# Altium project MGMEZZ02.PrjPcb (part 1 of 2)
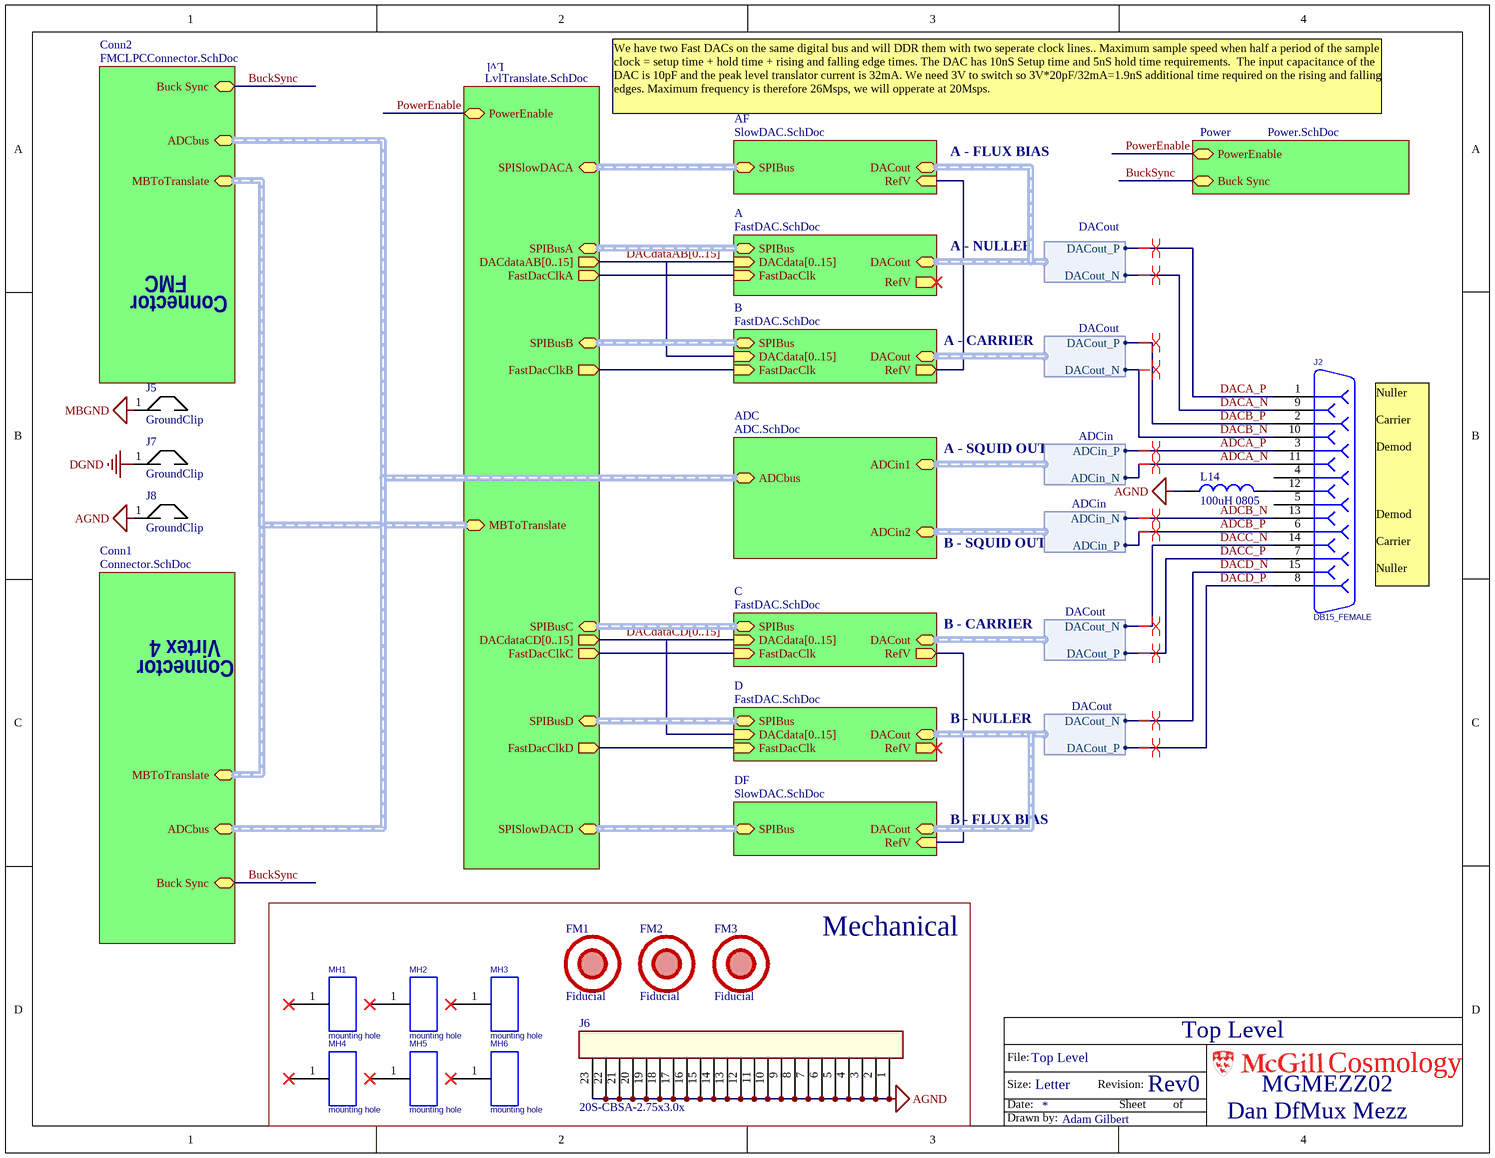
[diagram p0: MGMEZZ02.SchDoc]
ModelNumber: MGMEZZ02; ProjectTitle: Dan DfMux Mezz; Revision: Rev0
8 sheets, 571 parts. Net scope: hierarchical (ports join the sheet entries above them; power ports are global).
Board file: MGMEZZ02.PCBDOC
Sheets:
  MGMEZZ02.SchDoc
    ADC = ADC.SchDoc
    Power = Power.SchDoc
    A = FastDAC.SchDoc
    Conn1 = Connector.SchDoc
    Lvl = LvlTranslate.SchDoc
    AF = SlowDAC.SchDoc
    DF = SlowDAC.SchDoc
    Conn2 = FMCLPCConnector.SchDoc
    B = FastDAC.SchDoc
    C = FastDAC.SchDoc
    D = FastDAC.SchDoc

## Sheet MGMEZZ02.SchDoc: Top Level
size Letter; Author: Adam Gilbert; CompanyName: McGill University; DrawnBy: Adam Gilbert; Organization: Altium Limited; Address1: McGill Cosmology; Address2: 3600 University Street; Address3: Montreal, Quebec; Address4: Canada; Revision: Rev0; ProjectTitle: Dan DfMux Mezz; ModelNumber: MGMEZZ02; DocumentName: Top Level; ProjectName: Dan DfMux Mezz

### Parts
FM1  Fiducial  [Fiducial_mark]  (no BOM)
FM2  Fiducial  [Fiducial_mark]  (no BOM)
FM3  Fiducial  [Fiducial_mark]  (no BOM)
J2  DB15_FEMALE  [DSUB/RS.318/TM/15]
J5  GroundClip  [GroundClip]
J6  20S-CBSA-2.75x3.0x  [SHIELD 2.75X3.00]
J7  GroundClip  [GroundClip]
J8  GroundClip  [GroundClip]
L14  100uH 0805  [0805]
MH1  mounting hole  [MTHOLE.125]  (no BOM)
MH2  mounting hole  [MTHOLE.125]  (no BOM)
MH3  mounting hole  [MTHOLE.125]  (no BOM)
MH4  mounting hole  [MTHOLE.125]  (no BOM)
MH5  mounting hole  [MTHOLE.125]  (no BOM)
MH6  mounting hole  [MTHOLE.125]  (no BOM)

### Blocks framed on the sheet
Mechanical: FM1-FM3 J6 MH1-MH6

### Sub-sheets
A = FastDAC.SchDoc: DACout (harness DACout), SPIBus (harness SPIBus), FastDacClk (in), DACdata[0..15] (in), RefV (out)
ADC = ADC.SchDoc: ADCbus (harness ADCbus), ADCin1 (harness ADCin), ADCin2 (harness ADCin)
AF = SlowDAC.SchDoc: DACout (harness DACout), SPIBus (harness SPIBus), RefV (in)
B = FastDAC.SchDoc: DACout (harness DACout), SPIBus (harness SPIBus), FastDacClk (in), DACdata[0..15] (in), RefV (out)
C = FastDAC.SchDoc: DACout (harness DACout), SPIBus (harness SPIBus), FastDacClk (in), DACdata[0..15] (in), RefV (out)
Conn1 = Connector.SchDoc: ADCbus (harness ADCbus), MBToTranslate (harness MBToTranslate), Buck Sync
Conn2 = FMCLPCConnector.SchDoc: MBToTranslate (harness MBToTranslate), ADCbus (harness SlowDACin), Buck Sync
D = FastDAC.SchDoc: DACout (harness DACout), SPIBus (harness SPIBus), FastDacClk (in), DACdata[0..15] (in), RefV (out)
DF = SlowDAC.SchDoc: DACout (harness DACout), SPIBus (harness SPIBus), RefV (in)
Lvl = LvlTranslate.SchDoc: MBToTranslate (harness MBToTranslate), PowerEnable, SPISlowDACA (harness SPIBus), SPISlowDACD (harness SPIBus), SPIBusA (harness SPIBus), SPIBusB (harness SPIBus), SPIBusC (harness SPIBus), SPIBusD (harness SPIBus), DACdataAB[0..15] (out), FastDacClkA (out), FastDacClkB (out), DACdataCD[0..15] (out), FastDacClkC (out), FastDacClkD (out)
Power = Power.SchDoc: PowerEnable, Buck Sync

### Harnesses
ADCin: ADCin_P, ADCin_N
DACout: DACout_P, DACout_N

### Nets
AGND: J6.1 J6.2 J6.3 J6.4 J6.5 J6.6 J6.7 J6.8 J6.9 J6.10 J6.11 J6.12 J6.13 J6.14 J6.15 J6.16 J6.17 J6.18 J6.19 J6.20 J6.21 J6.22 J6.23 J8.1 L14.1
DGND: J7.1
MBGND: J5.1
ADCA_N: J2.11(p11) ; sheet ADC/ADCin1.ADCin_N
ADCA_P: J2.3(p3) ; sheet ADC/ADCin1.ADCin_P
ADCB_N: J2.13(p13) ; sheet ADC/ADCin2.ADCin_N
ADCB_P: J2.6(p6) ; sheet ADC/ADCin2.ADCin_P
BuckSync: sheet Power/Buck Sync, sheet Conn1/Buck Sync, sheet Conn2/Buck Sync
DACA_N: J2.9(p9) ; sheet A/DACout.DACout_N
DACA_P: J2.1(p1) ; sheet A/DACout.DACout_P
DACB_N: J2.10(p10) ; sheet B/DACout.DACout_N
DACB_P: J2.2(p2) ; sheet B/DACout.DACout_P
DACC_N: J2.14(p14) ; sheet C/DACout.DACout_N
DACC_P: J2.7(p7) ; sheet C/DACout.DACout_P
DACD_N: J2.15(p15) ; sheet DF/DACout.DACout_N
DACD_P: J2.8(p8) ; sheet DF/DACout.DACout_P
FastDacClk: sheet A/FastDacClk, sheet Lvl/FastDacClkA
FastDacClk: sheet Lvl/FastDacClkB, sheet B/FastDacClk  [a separate net that carries the same name]
FastDacClk: sheet Lvl/FastDacClkC, sheet C/FastDacClk  [a separate net that carries the same name]
FastDacClk: sheet Lvl/FastDacClkD, sheet D/FastDacClk  [a separate net that carries the same name]
PowerEnable: sheet Power/PowerEnable, sheet Lvl/PowerEnable
RefVolt: sheet AF/RefV, sheet B/RefV
RefVolt: sheet DF/RefV, sheet C/RefV  [a separate net that carries the same name]
NetJ2_12: J2.12(p12) L14.2

Not connected (* = marked no-connect by the designer): J2 4(p4) 5(p5); MH1 1(A)*; MH2 1(A)*; MH3 1(A)*; MH4 1(A)*; MH5 1(A)*; MH6 1(A)*

### Buses and harness runs
bus DACdataAB[0..15] = sheet A/DACdata[0..15] = sheet B/DACdata[0..15] = sheet Lvl/DACdataAB[0..15]
bus DACdataCD[0..15] = sheet C/DACdata[0..15] = sheet D/DACdata[0..15] = sheet Lvl/DACdataCD[0..15]
harness sheet A/DACout = sheet AF/DACout
harness sheet A/SPIBus = sheet Lvl/SPIBusA
harness sheet ADC/ADCbus = sheet Conn1/ADCbus = sheet Conn2/ADCbus
harness sheet AF/SPIBus = sheet Lvl/SPISlowDACA
harness sheet B/SPIBus = sheet Lvl/SPIBusB
harness sheet C/SPIBus = sheet Lvl/SPIBusC
harness sheet Conn1/MBToTranslate = sheet Conn2/MBToTranslate = sheet Lvl/MBToTranslate
harness sheet D/DACout = sheet DF/DACout
harness sheet D/SPIBus = sheet Lvl/SPIBusD
harness sheet DF/SPIBus = sheet Lvl/SPISlowDACD

### Layout directives
differential pair: ADCA_N, ADCA_P, ADCB_N, ADCB_P, DACA_N, DACA_P, DACB_N, DACB_P, DACC_N, DACC_P, DACD_N, DACD_P

### Notes on the sheet
- We have two Fast DACs on the same digital bus and will DDR them with two seperate clock lines.. Maximum sample speed when half a period of the sample clock = setup time + hold time + rising and falling edge times. The DAC has 10nS Setup time and 5nS hold time requirements.  The input capacitance of the DAC is 10pF and the peak level translator current is 32mA. We need 3V to switch so 3V*20pF/32mA=1.9nS additional time required on the rising and falling edges. Maximum frequency is therefore 26Msps, we will opperate at 20Msps.
- A - FLUX BIAS
- FMC
- Connector
- A - NULLER
- A - CARRIER
- A - SQUID OUT
- B - SQUID OUT
- Virtex 4
- B - CARRIER
- Nuller
  Carrier
  Demod
  Demod
  Carrier
  Nuller
- B - NULLER
- B - FLUX BIAS
- File:
- Size:
- Date:
- Letter
- Revision:
- Sheet
- of
- Cosmology
- Drawn by:

### Library data of the parts
FM1-FM3 = Fiducial: Assembly Comments: none; Type: Fiducial; SupplierUnitCost: 0
J2 = DB15_FEMALE: Part Constraints: 182-015-213R181; Manufacturer: Norcomp; Assembly Comments: none; Manufacturers Part Number: 182-015-213R181; Supplier 1: Digi-Key; Supplier Part Number 1: 182-815FE-ND
J5 J7 J8 = GroundClip: Ground Clip point; Manufacturer: Keystone Electronics; Part Constraints: 5015; Assembly Comments: none; SupplierUnitCost: $0.53; Type: Ground clip point; Supplier 1: Digi-Key; Supplier Part Number 1: 5015KCT-ND; Manufacturers Part Number: 5015
J6 = MezzShield
L14 = IND 0805: Inductor 0805; Manufacturer: TDK Corporation; Manufacturers Part Number: GLCR2012T101M-HC; Part Constraints: 100uH, 4.5Ohms DRC, Irms 40mA; Assembly Comments: none; Type: Inductor; SupplierUnitCost: $0.33; Value: 100uH 0805
MH1-MH6 = MTHOLE

## Sheet ADC.SchDoc: ADC
size Letter; DrawnBy: AdamGilbert; Engineer: AdamGilbert; Revision: Rev0
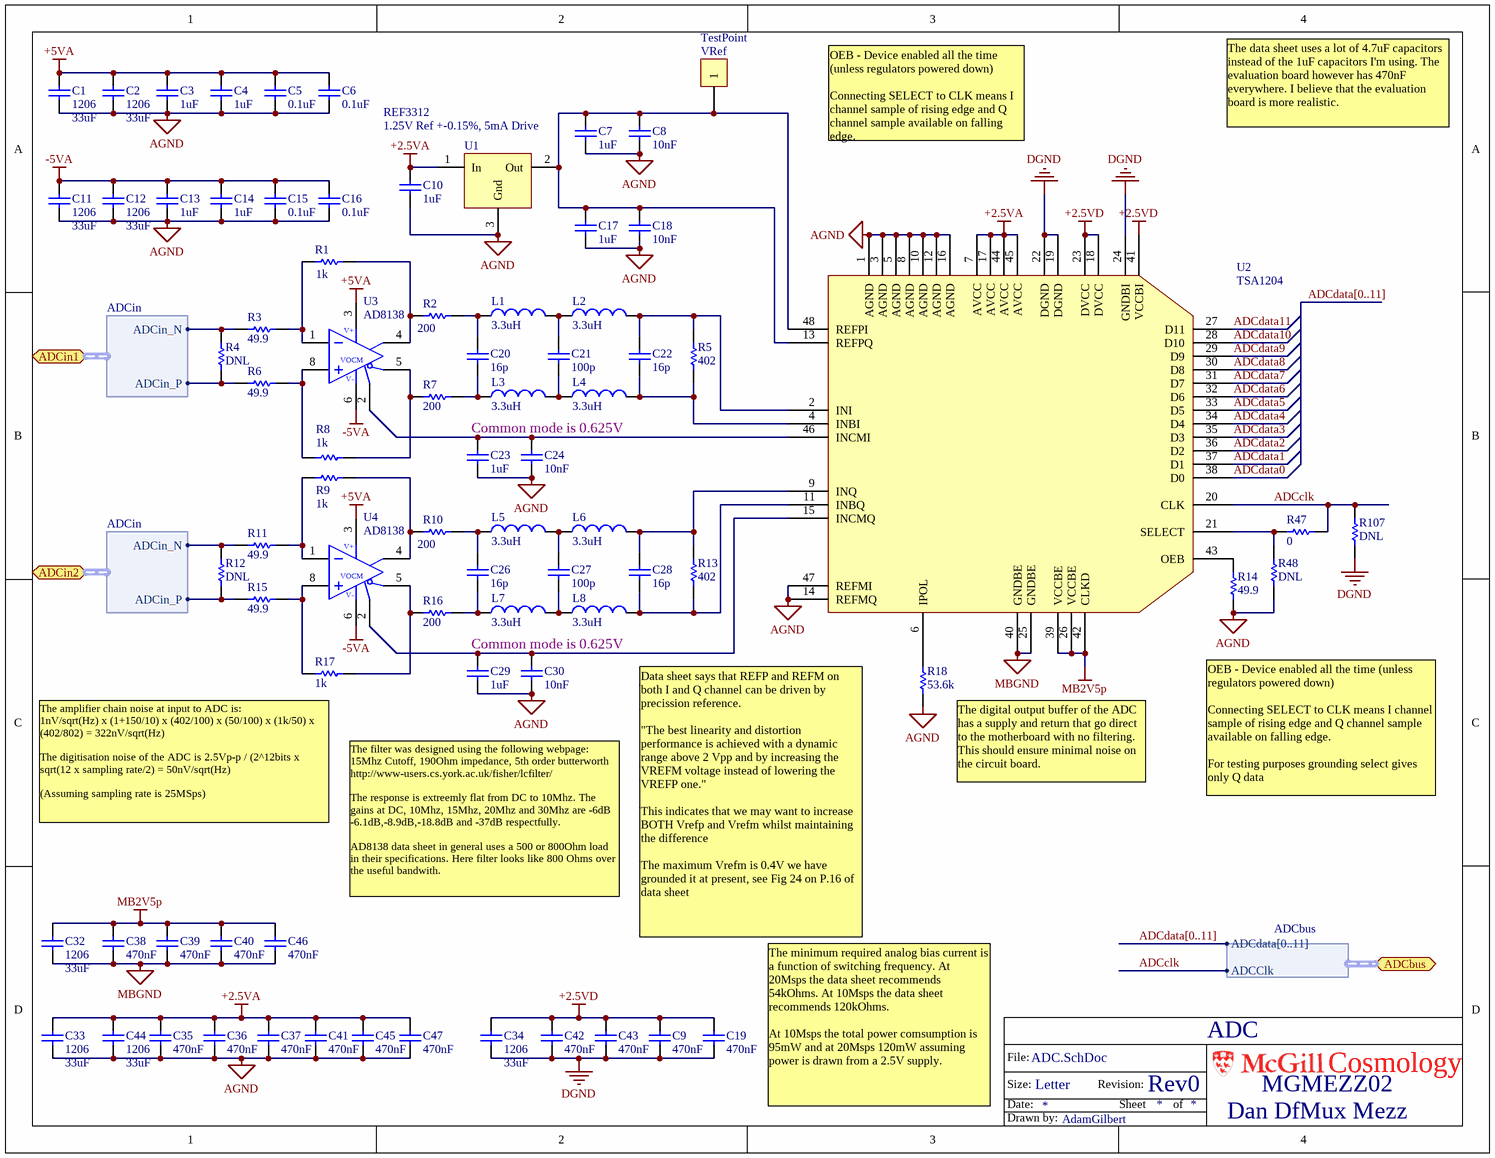
[diagram p1: ADC.SchDoc]

### Parts
C1  Footprint: 1206  [CC3225-1210]  (hidden comment: 33uF)
C2  Footprint: 1206  [CC3225-1210]  (hidden comment: 33uF)
C3  1uF  [0603]
C4  1uF  [0603]
C5  0.1uF  [0603]
C6  0.1uF  [0603]
C7  1uF  [0603]
C8  10nF  [0603]
C9  470nF  [0603]
C10  1uF  [0603]
C11  Footprint: 1206  [CC3225-1210]  (hidden comment: 33uF)
C12  Footprint: 1206  [CC3225-1210]  (hidden comment: 33uF)
C13  1uF  [0603]
C14  1uF  [0603]
C15  0.1uF  [0603]
C16  0.1uF  [0603]
C17  1uF  [0603]
C18  10nF  [0603]
C19  470nF  [0603]
C20  16p  [0603]
C21  100p  [0603]
C22  16p  [0603]
C23  1uF  [0603]
C24  10nF  [0603]
C26  16p  [0603]
C27  100p  [0603]
C28  16p  [0603]
C29  1uF  [0603]
C30  10nF  [0603]
C32  Footprint: 1206  [CC3225-1210]  (hidden comment: 33uF)
C33  Footprint: 1206  [CC3225-1210]  (hidden comment: 33uF)
C34  Footprint: 1206  [CC3225-1210]  (hidden comment: 33uF)
C35  470nF  [0603]
C36  470nF  [0603]
C37  470nF  [0603]
C38  470nF  [0603]
C39  470nF  [0603]
C40  470nF  [0603]
C41  470nF  [0603]
C42  470nF  [0603]
C43  470nF  [0603]
C44  Footprint: 1206  [CC3225-1210]  (hidden comment: 33uF)
C45  470nF  [0603]
C46  470nF  [0603]
C47  470nF  [0603]
L1  3.3uH  [0603]
L2  3.3uH  [0603]
L3  3.3uH  [0603]
L4  3.3uH  [0603]
L5  3.3uH  [0603]
L6  3.3uH  [0603]
L7  3.3uH  [0603]
L8  3.3uH  [0603]
R1  1k  [0603]
R2  200  [0603]
R3  49.9  [0603]
R4  DNL  [0603]
R5  402  [0603]
R6  49.9  [0603]
R7  200  [0603]
R8  1k  [0603]
R9  1k  [0603]
R10  200  [0603]
R11  49.9  [0603]
R12  DNL  [0603]
R13  402  [0603]
R14  49.9  [0603]
R15  49.9  [0603]
R16  200  [0603]
R17  1k  [0603]
R18  53.6k  [0603]
R47  0  [0603]
R48  DNL  [0603]
R107  DNL  [0603]
U1  REF3312  Description: 1.25V Ref +-0.15%, 5mA Drive  [SOT23]
U2  TSA1204  [TSQFP50P900X900X160-48N]
U3  AD8138  [SO8]
U4  AD8138  [SO8]
VRef  TestPoint  [TP-3520-SK]  (no BOM)

### Ports
ADCbus (harness ADCbus), ADCin1 (harness ADCin), ADCin2 (harness ADCin)

### Harnesses
ADCin: ADCin_P, ADCin_N
ADCbus: ADCdata[0..11], ADCClk

### Nets
+2.5VA: C10.2 C33.2 C35.2 C36.2 C37.2 C41.2 C44.2 C45.2 C47.2 U1.1(In) U2.7(AVCC) U2.17(AVCC) U2.44(AVCC) U2.45(AVCC)
+2.5VD: C9.2 C19.2 C34.2 C42.2 C43.2 U2.18(DVCC) U2.23(DVCC) U2.41(VCCBI)
+5VA: C1.2 C2.2 C3.2 C4.2 C5.1 C6.1 U3.3(V+) U4.3(V+)
-5VA: C11.2 C12.2 C13.2 C14.2 C15.1 C16.1 U3.6(V-) U4.6(V-)
AGND: C1.1 C2.1 C3.1 C4.1 C5.2 C6.2 C7.1 C8.1 C10.1 C11.1 C12.1 C13.1 C14.1 C15.2 C16.2 C17.1 C18.1 C23.1 C24.1 C29.1 C30.1 C33.1 C35.1 C36.1 C37.1 C41.1 C44.1 C45.1 C47.1 R14.1 R18.1 R48.2 U1.3(Gnd) U2.1(AGND) U2.3(AGND) U2.5(AGND) U2.8(AGND) U2.10(AGND) U2.12(AGND) U2.14(REFMQ) U2.16(AGND) U2.47(REFMI)
DGND: C9.1 C19.1 C34.1 C42.1 C43.1 R107.1 U2.19(DGND) U2.22(DGND) U2.24(GNDBI)
MB2V5p: C32.2 C38.2 C39.2 C40.2 C46.2 U2.26(VCCBE) U2.39(VCCBE) U2.42(CLKD)
MBGND: C32.1 C38.1 C39.1 C40.1 C46.1 U2.25(GNDBE) U2.40(GNDBE)
ADCA_N: R3.2 R4.2 ; port ADCin1.ADCin_N
ADCA_P: R4.1 R6.2 ; port ADCin1.ADCin_P
ADCB_N: R11.2 R12.2 ; port ADCin2.ADCin_N
ADCB_P: R12.1 R15.2 ; port ADCin2.ADCin_P
ADCclk: R47.1 R107.2 U2.20(CLK) ; port ADCbus.ADCClk
ADCdata0: U2.38(D0)
ADCdata1: U2.37(D1)
ADCdata2: U2.36(D2)
ADCdata3: U2.35(D3)
ADCdata4: U2.34(D4)
ADCdata5: U2.33(D5)
ADCdata6: U2.32(D6)
ADCdata7: U2.31(D7)
ADCdata8: U2.30(D8)
ADCdata9: U2.29(D9)
ADCdata10: U2.28(D10)
ADCdata11: U2.27(D11)
NetC7_2: C7.2 C8.2 C17.2 C18.2 U1.2(Out) U2.13(REFPQ) U2.48(REFPI) VRef.1
NetC20_1: C20.1 L3.1 R7.1
NetC20_2: C20.2 L1.1 R2.1
NetC21_1: C21.1 L3.2 L4.1
NetC21_2: C21.2 L1.2 L2.1
NetC22_1: C22.1 L4.2 R5.2 U2.4(INBI)
NetC22_2: C22.2 L2.2 R5.1 U2.2(INI)
NetC23_2: C23.2 C24.2 U2.46(INCMI) U3.2(VOCM)
NetC26_1: C26.1 L7.1 R16.1
NetC26_2: C26.2 L5.1 R10.1
NetC27_1: C27.1 L7.2 L8.1
NetC27_2: C27.2 L5.2 L6.1
NetC28_1: C28.1 L8.2 R13.2 U2.11(INBQ)
NetC28_2: C28.2 L6.2 R13.1 U2.9(INQ)
NetC29_2: C29.2 C30.2 U2.15(INCMQ) U4.2(VOCM)
NetR1_1: R1.1 R2.2 U3.4(OUT+)
NetR1_2: R1.2 R3.1 U3.1(IN-)
NetR6_1: R6.1 R8.2 U3.8(IN+)
NetR7_2: R7.2 R8.1 U3.5(OUT-)
NetR9_1: R9.1 R10.2 U4.4(OUT+)
NetR9_2: R9.2 R11.1 U4.1(IN-)
NetR14_2: R14.2 U2.43(OEB)
NetR15_1: R15.1 R17.2 U4.8(IN+)
NetR16_2: R16.2 R17.1 U4.5(OUT-)
NetR18_2: R18.2 U2.6(IPOL)
NetR47_2: R47.2 R48.1 U2.21(SELECT)

Not connected (* = marked no-connect by the designer): U3 7(NC); U4 7(NC)

### Buses and harness runs
bus ADCdata[0..11]

### Notes on the sheet
- OEB - Device enabled all the time (unless regulators powered down)
  Connecting SELECT to CLK means I channel sample of rising edge and Q channel sample available on falling edge.
  For testing purposes grounding select gives only Q data
- The data sheet uses a lot of 4.7uF capacitors instead of the 1uF capacitors I'm using. The evaluation board however has 470nF everywhere. I believe that the evaluation board is more realistic.
- Common mode is 0.625V
- (near R18) The digital output buffer of the ADC has a supply and return that go direct to the motherboard with no filtering. This should ensure minimal noise on the circuit board.
- (near R17) The amplifier chain noise at input to ADC is:
  1nV/sqrt(Hz) x (1+150/10) x (402/100) x (50/100) x (1k/50) x (402/802) = 322nV/sqrt(Hz)
  The digitisation noise of the ADC is 2.5Vp-p / (2^12bits x sqrt(12 x sampling rate/2) = 50nV/sqrt(Hz)
  (Assuming sampling rate is 25MSps)
- The filter was designed using the following webpage:
  15Mhz Cutoff, 190Ohm impedance, 5th order butterworth
  http://www-users.cs.york.ac.uk/fisher/lcfilter/
  The response is extreemly flat from DC to 10Mhz. The gains at DC, 10Mhz, 15Mhz, 20Mhz and 30Mhz are -6dB -6.1dB,-8.9dB,-18.8dB and -37dB respectfully.
  AD8138 data sheet in general uses a 500 or 800Ohm load in their specifications. Here filter looks like 800 Ohms over the useful bandwith.
- Data sheet says that REFP and REFM on both I and Q channel can be driven by precission reference.
  "The best linearity and distortion performance is achieved with a dynamic range above 2 Vpp and by increasing the VREFM voltage instead of lowering the VREFP one."
  This indicates that we may want to increase BOTH Vrefp and Vrefm whilst maintaining the difference
  The maximum Vrefm is 0.4V we have grounded it at present, see Fig 24 on P.16 of data sheet
- The minimum required analog bias current is a function of switching frequency. At 20Msps the data sheet recommends 54kOhms. At 10Msps the data sheet recommends 120kOhms.
  At 10Msps the total power comsumption is 95mW and at 20Msps 120mW assuming power is drawn from a 2.5V supply.
- File:
- Size:
- Date:
- Letter
- Revision:
- Sheet
- of
- Cosmology
- Drawn by:

### Library data of the parts
C1 C2 C11 C12 C32-C34 C44 = CAP 1210: Capacitor, Ceramic, 1210; Manufacturer: TDK Corporation; Part Constraints: 33uF or 47uF  (1206 or 1210) 25V X5R; Manufacturers Part Number: C3216X5R1E336M; Assembly Comments: none; Type: Capacitor; SupplierUnitCost: $1.1; Value: 33uF; Supplier 1: Digi-Key; Supplier Part Number 1: 445-8046-1-ND
C3 C4 C7 C13 C14 C17 C23 C29 = CAP 0603: Capacitor, Ceramic, 0603; Part Constraints: 10% 16V X7R 0603; Manufacturer: Generic; Manufacturers Part Number: e.g C1608X7R1C105K; Assembly Comments: none; Value: 1uF; Type: Capacitor; SupplierUnitCost: $0.12
C5 C6 C15 C16 C35-C41 C45-C47 = CAP 0603: Capacitor, Ceramic, 0603; Part Constraints: 10% 16V X7R 0603; Manufacturer: Generic; Manufacturers Part Number: Generic; Type: Capacitor; SupplierUnitCost: 0
  C5 C6 C15 C16: Value: 0.1uF
  C35-C41 C45-C47: Value: 470nF
C8 C9 C18-C22 C24 C26-C28 C30 C42 C43 = CAP 0603: Capacitor, Ceramic, 0603; Part Constraints: 10% 16V X7R 0603; Manufacturer: Generic; Assembly Comments: none; Manufacturers Part Number: Generic; Type: Capacitor; SupplierUnitCost: 0
  C8 C18 C24 C30: Value: 10nF
  C9 C19 C42 C43: Value: 470nF
  C20 C22 C26 C28: Value: 16p
  C21 C27: Value: 100p
C10 = CAP 0603: Capacitor, Ceramic, 0603; Part Constraints: 10% 16V X7R 0603; Manufacturer: Generic; Manufacturers Part Number: e.g C1608X7R1C105K; Value: 1uF; Type: Capacitor; SupplierUnitCost: $0.12
L1-L8 = IND 0603: Inductor 0603; Manufacturer: TDK Coporation; Manufacturers Part Number: MLF1608A4R7K; Part Constraints: 30mA 0603 10% shielded 1.6Ohms 80Mhz SRF; Assembly Comments: none; Type: Inductor; SupplierUnitCost: $0.21; Value: 3.3uH; Supplier 1: Digi-Key; Supplier Part Number 1: 445-1021-1-ND
R1-R18 R47 R48 R107 = RES 0603: Resistor; Manufacturer: Generic; Part Constraints: 1% 1/10W 100ppm 0603; Manufacturers Part Number: Generic; Type: Resistor; SupplierUnitCost: 0
  R1 R8 R9 R17: Value: 1k
  R2 R7 R10 R16: Value: 200
  R3 R6 R11 R14 R15: Value: 49.9
  R4 R12 R48 R107: Value: DNL
  R5 R13: Value: 402
  R18: Value: 53.6k
  R47: Value: 0
U1 = REF3312AIDBZT: Vref 1.25V , +-0.15%, 5mA Output, SOT-23-3; Manufacturer: Texas Instruments; Manufacturers Part Number: REF3312AIDBZT; Part Constraints: REF3312AIDBZT; Type: IC; Supplier 1: Digi-Key; Supplier Part Number 1: 296-22635-6-ND
U2 = TSA1204: ADC 2-Channel 12bit; Part Constraints: TSA1204IFT; Manufacturer: STMicroelectronics; Assembly Comments: none; Manufacturers Part Number: TSA1204IFT; Supplier 1: Digi-Key; Supplier Part Number 1: 497-5435-1-ND; Type: IC; SupplierUnitCost: $23.95
U3 U4 = AD8138: IC AMP DIFF LDIST LP 95MA 8SOIC; Manufacturer: Analog Devices Inc; Manufacturers Part Number: AD8138ARZ; Assembly Comments: none; Supplier 1: Digi-Key; RoHS: RoHS Compliant; Category: Integrated Circuits (ICs); Type: IC; Applications: Data Acquisition; Mounting Type: Surface Mount; Package / Case: 8-SOIC (0.154", 3.90mm Width); Supplier Device Package: 8-SOIC; Packaging: Tube; ComponentLink1URL: http://www.analog.com/static/imported-files/data_sheets/AD8138.pdf; ComponentLink1Description: http://www.analog.com/static/imported-files/data_sheets/AD8138.pdf; Part Constraints: AD8138ARZ; SupplierUnitCost: $6.44
VRef = TestPoint: TestPoint1; Assembly Comments: none; Footprint: *; Type: Test Point; SupplierUnitCost: 0

## Sheet Power.SchDoc: Power
size Letter; DrawnBy: AdamGilbert; Engineer: AdamGilbert; Revision: Rev0; DocumentName: Power
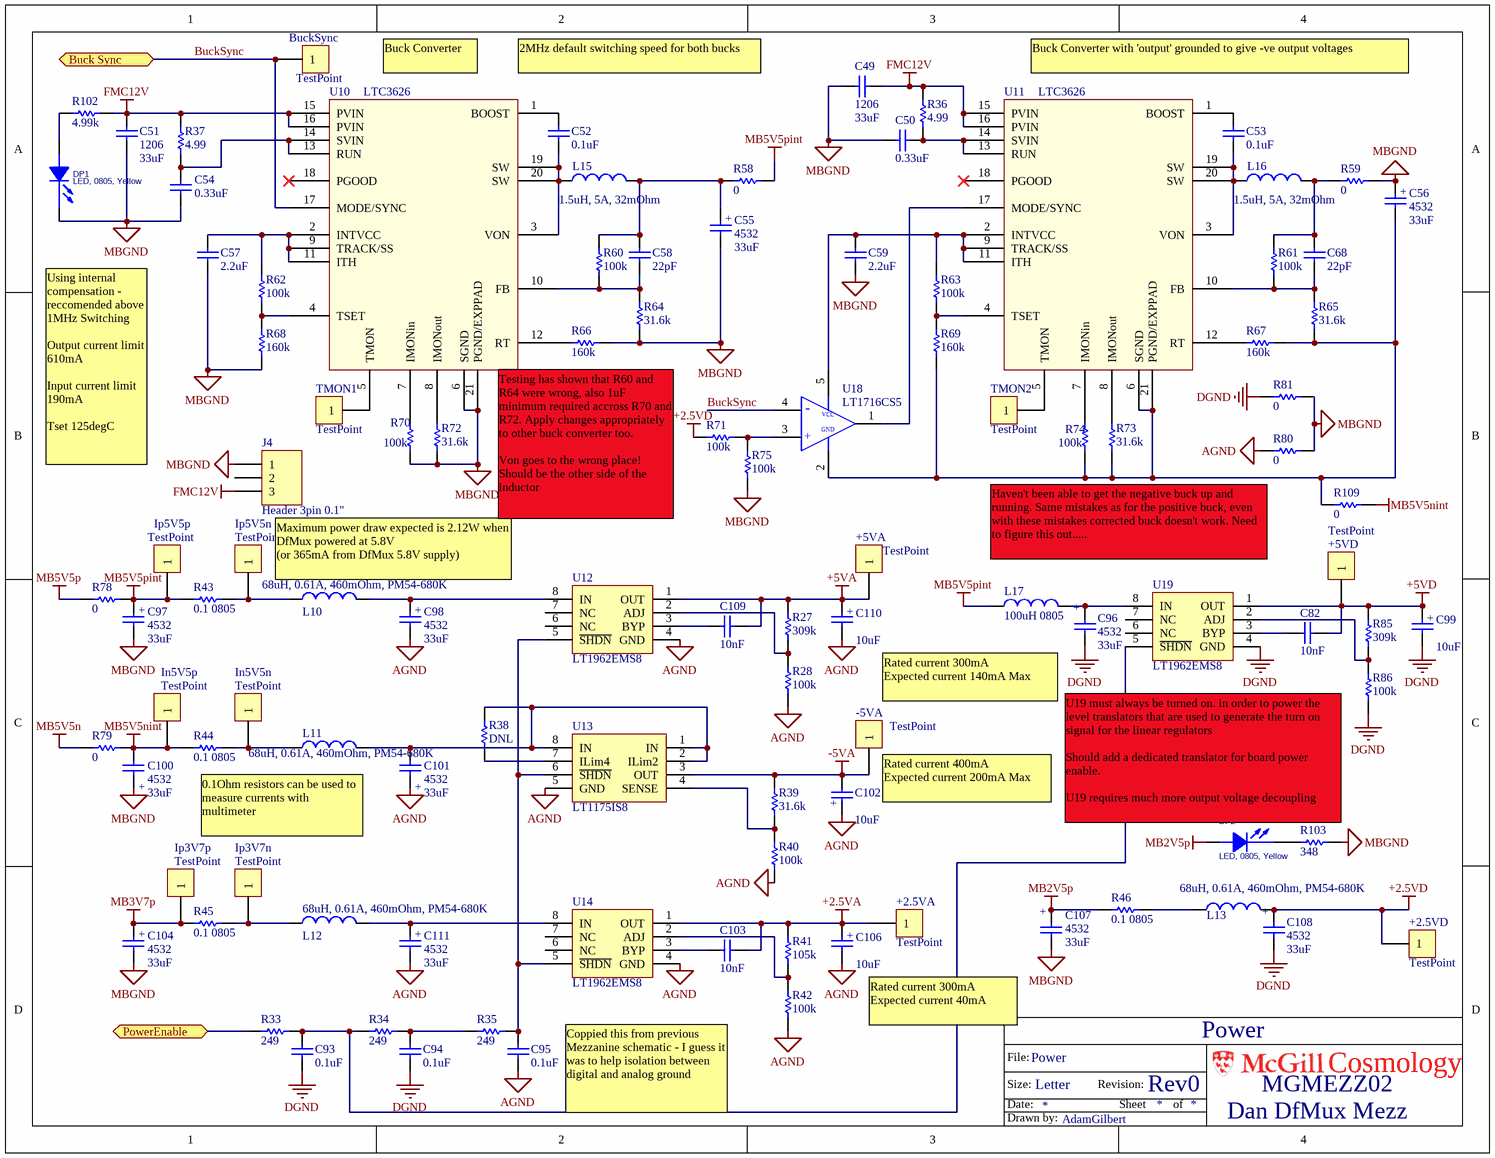
[diagram p2: Power.SchDoc]

### Parts
+2.5VA  TestPoint  [TP-3520-SK]  (no BOM)
+2.5VD  TestPoint  [TP-3520-SK]  (no BOM)
+5VA  TestPoint  [TP-3520-SK]  (no BOM)
+5VD  TestPoint  [TP-3520-SK]  (no BOM)
-5VA  TestPoint  [TP-3520-SK]  (no BOM)
BuckSync  TestPoint  [TP-3520-SK]  (no BOM)
C49  Footprint: 1206  [CC3225-1210]  (hidden comment: 33uF)
C50  0.33uF  [0603]
C51  Footprint: 1206  [CC3225-1210]  (hidden comment: 33uF)
C52  0.1uF  [0603]
C53  0.1uF  [0603]
C54  0.33uF  [0603]
C55  Footprint: 4532  [TANT4532]  (hidden comment: 33uF)
C56  Footprint: 4532  [TANT4532]  (hidden comment: 33uF)
C57  2.2uF  [0603]
C58  22pF  [0603]
C59  2.2uF  [0603]
C68  22pF  [0603]
C82  10nF  [0603]
C93  0.1uF  [0603]
C94  0.1uF  [0603]
C95  0.1uF  [0603]
C96  Footprint: 4532  [TANT4532]  (hidden comment: 33uF)
C97  Footprint: 4532  [TANT4532]  (hidden comment: 33uF)
C98  Footprint: 4532  [TANT4532]  (hidden comment: 33uF)
C99  10uF  [TCASE-A]
C100  Footprint: 4532  [TANT4532]  (hidden comment: 33uF)
C101  Footprint: 4532  [TANT4532]  (hidden comment: 33uF)
C102  10uF  [TCASE-A]
C103  10nF  [0603]
C104  Footprint: 4532  [TANT4532]  (hidden comment: 33uF)
C106  10uF  [TCASE-A]
C107  Footprint: 4532  [TANT4532]  (hidden comment: 33uF)
C108  Footprint: 4532  [TANT4532]  (hidden comment: 33uF)
C109  10nF  [0603]
C110  10uF  [TCASE-A]
C111  Footprint: 4532  [TANT4532]  (hidden comment: 33uF)
DP1  LED, 0805, Yellow  [0805L]
DP2  LED, 0805, Yellow  [0805L]
In5V5n  TestPoint  [TP-3520-SK]  (no BOM)
In5V5p  TestPoint  [TP-3520-SK]  (no BOM)
Ip3V7n  TestPoint  [TP-3520-SK]  (no BOM)
Ip3V7p  TestPoint  [TP-3520-SK]  (no BOM)
Ip5V5n  TestPoint  [TP-3520-SK]  (no BOM)
Ip5V5p  TestPoint  [TP-3520-SK]  (no BOM)
J4  Header 3pin 0.1"  [HDR1X3_MolexVertical]
L10  Part Constraints: 68uH, 0.61A, 460mOhm, PM54-680K  [CHOKEPM54]  (hidden comment: 68uH)
L11  Part Constraints: 68uH, 0.61A, 460mOhm, PM54-680K  [CHOKEPM54]  (hidden comment: 68uH)
L12  Part Constraints: 68uH, 0.61A, 460mOhm, PM54-680K  [CHOKEPM54]  (hidden comment: 68uH)
L13  Part Constraints: 68uH, 0.61A, 460mOhm, PM54-680K  [CHOKEPM54]  (hidden comment: 68uH)
L15  Part Constraints: 1.5uH, 5A, 32mOhm  [IHLP-1212]  (hidden comment: 1.5uH)
L16  Part Constraints: 1.5uH, 5A, 32mOhm  [IHLP-1212]  (hidden comment: 1.5uH)
L17  100uH 0805  [0805]
R27  309k  [0603]
R28  100k  [0603]
R33  249  [0603]
R34  249  [0603]
R35  249  [0603]
R36  4.99  [0603]
R37  4.99  [0603]
R38  DNL  [0603]
R39  31.6k  [0603]
R40  100k  [0603]
R41  105k  [0603]
R42  100k  [0603]
R43  0.1 0805  [0805]
R44  0.1 0805  [0805]
R45  0.1 0805  [0805]
R46  0.1 0805  [0805]
R58  0  [0805]
R59  0  [0805]
R60  100k  [0603]
R61  100k  [0603]
R62  100k  [0603]
R63  100k  [0603]
R64  31.6k  [0603]
R65  31.6k  [0603]
R66  160k  [0603]
R67  160k  [0603]
R68  160k  [0603]
R69  160k  [0603]
R70  100k  [0603]
R71  100k  [0603]
R72  31.6k  [0603]
R73  31.6k  [0603]
R74  100k  [0603]
R75  100k  [0603]
R78  0  [0805]
R79  0  [0805]
R80  0  [1206]
R81  0  [1206]
R85  309k  [0603]
R86  100k  [0603]
R102  4.99k  [0603]
R103  348  [0603]
R109  0  [0805]
TMON1  TestPoint  [TP-3520-SK]  (no BOM)
TMON2  TestPoint  [TP-3520-SK]  (no BOM)
U10  LTC3626  [LTC3626]
U11  LTC3626  [LTC3626]
U12  LT1962EMS8  [MSOP-8]
U13  LT1175IS8  [SO8]
U14  LT1962EMS8  [MSOP-8]
U18  LT1716CS5  [SOT23-5]
U19  LT1962EMS8  [MSOP-8]

### Ports
Buck Sync, PowerEnable

### Nets
+2.5VA: +2.5VA.1 C103.2 C106.1 R41.1 U14.1(OUT)
+2.5VD: +2.5VD.1 C108.1 L13.1 R71.2
+5VA: +5VA.1 C109.2 C110.1 R27.1 U12.1(OUT)
+5VD: +5VD.1 C82.2 C99.1 R85.1 U19.1(OUT)
-5VA: -5VA.1 C102.2 R39.1 U13.3(OUT)
AGND: C95.2 C98.2 C101.1 C102.1 C106.2 C110.2 C111.2 R28.2 R40.2 R42.2 R80.2 U12.4(GND) U13.5(GND) U14.4(GND)
DGND: C93.1 C94.2 C96.2 C99.2 C108.2 R81.2 R86.2 U19.4(GND)
FMC12V: C49.1 C51.1 J4.3 R36.2 R37.1 R102.2 U10.15(PVIN) U10.16(PVIN) U11.15(PVIN) U11.16(PVIN)
MB2V5p: C107.1 DP2.1(ANODE) R46.1
MB3V7p: C104.1 Ip3V7p.1 R45.1
MB5V5n: R79.1
MB5V5nint: C100.2 In5V5p.1 R44.1 R79.2 R109.1
MB5V5p: R78.1
MB5V5pint: C97.1 Ip5V5p.1 L17.1 R43.1 R58.2 R78.2
MBGND: C49.2 C50.1 C51.2 C54.1 C55.2 C56.1 C57.1 C59.1 C97.2 C100.1 C104.2 C107.2 DP1.2(CATHODE) J4.1 R59.2 R64.1 R66.1 R68.2 R70.1 R72.1 R75.2 R80.1 R81.1 R103.1 U10.6(SGND) U10.21(PGND/EXPPAD)
BuckSync: BuckSync.1 U10.17(MODE/SYNC) U18.4(-) ; port Buck Sync
PowerEnable: R33.1 ; port PowerEnable
NetC50_2: C50.2 R36.1 U11.13(RUN) U11.14(SVIN)
NetC52_1: C52.1 L15.1 U10.3(VON) U10.19(SW) U10.20(SW)
NetC52_2: C52.2 U10.1(BOOST)
NetC53_1: C53.1 L16.1 U11.3(VON) U11.19(SW) U11.20(SW)
NetC53_2: C53.2 U11.1(BOOST)
NetC54_2: C54.2 R37.2 U10.13(RUN) U10.14(SVIN)
NetC55_1: C55.1 C58.2 L15.2 R58.1 R60.2
NetC56_2: C56.2 R65.1 R67.1 R69.2 R73.1 R74.1 R109.2 U11.6(SGND) U11.21(PGND/EXPPAD) U18.2(A)
NetC57_2: C57.2 R62.2 U10.2(INTVCC) U10.9(TRACK/SS) U10.11(ITH)
NetC58_1: C58.1 R60.1 R64.2 U10.10(FB)
NetC59_2: C59.2 R63.2 U11.2(INTVCC) U11.9(TRACK/SS) U11.11(ITH) U18.5(Vcc)
NetC68_1: C68.1 R61.1 R65.2 U11.10(FB)
NetC68_2: C68.2 L16.2 R59.1 R61.2
NetC82_1: C82.1 U19.3(BYP)
NetC93_2: C93.2 R33.2 R34.1 U19.5(~{SHDN})
NetC94_1: C94.1 R34.2 R35.1
NetC95_1: C95.1 R35.2 U12.5(~{SHDN}) U13.6(~{SHDN}) U14.5(~{SHDN})
NetC96_1: C96.1 L17.2 U19.8(IN)
NetC98_1: C98.1 L10.2 U12.8(IN)
NetC101_2: C101.2 L11.1 R38.2 U13.1(IN) U13.2(ILim2) U13.8(IN)
NetC103_1: C103.1 U14.3(BYP)
NetC109_1: C109.1 U12.3(BYP)
NetC111_1: C111.1 L12.2 U14.8(IN)
NetDP1_1: DP1.1(ANODE) R102.1
NetDP2_2: DP2.2(CATHODE) R103.2
NetIn5V5n_1: In5V5n.1 L11.2 R44.2
NetIp3V7n_1: Ip3V7n.1 L12.1 R45.2
NetIp5V5n_1: Ip5V5n.1 L10.1 R43.2
NetL13_2: L13.2 R46.2
NetR27_2: R27.2 R28.1 U12.2(ADJ)
NetR38_1: R38.1 U13.7(ILim4)
NetR39_2: R39.2 R40.1 U13.4(SENSE)
NetR41_2: R41.2 R42.1 U14.2(ADJ)
NetR62_1: R62.1 R68.1 U10.4(TSET)
NetR63_1: R63.1 R69.1 U11.4(TSET)
NetR66_2: R66.2 U10.12(RT)
NetR67_2: R67.2 U11.12(RT)
NetR70_2: R70.2 U10.7(IMONin)
NetR71_1: R71.1 R75.1 U18.3(+)
NetR72_2: R72.2 U10.8(IMONout)
NetR73_2: R73.2 U11.8(IMONout)
NetR74_2: R74.2 U11.7(IMONin)
NetR85_2: R85.2 R86.1 U19.2(ADJ)
NetTMON1_1: TMON1.1 U10.5(TMON)
NetTMON2_1: TMON2.1 U11.5(TMON)
NetU11_17: U11.17(MODE/SYNC) U18.1(Out)

Not connected (* = marked no-connect by the designer): J4 2; U10 18(PGOOD)*; U11 18(PGOOD)*; U12 6(NC) 7(NC); U14 6(NC) 7(NC); U19 6(NC) 7(NC)

### Notes on the sheet
- (near U10) Buck Converter
- 2MHz default switching speed for both bucks
- Buck Converter with 'output' grounded to give -ve output voltages
- Using internal compensation - reccomended above 1MHz Switching
  Output current limit 610mA
  Input current limit 190mA
  Tset 125degC
- (near U10) Testing has shown that R60 and R64 were wrong, also 1uF minimum required accross R70 and R72. Apply changes appropriately to other buck converter too.
  Von goes to the wrong place! Should be the other side of the inductor
- Haven't been able to get the negative buck up and running. Same mistakes as for the positive buck, even with these mistakes corrected buck doesn't work. Need to figure this out.....
- Maximum power draw expected is 2.12W when DfMux powered at 5.8V
  (or 365mA from DfMux 5.8V supply)
- Rated current 300mA
  Expected current 140mA Max
- 0.1Ohm resistors can be used to measure currents with multimeter
- (near -5VA) Rated current 400mA
  Expected current 200mA Max
- U19 must always be turned on. in order to power the level translators that are used to generate the turn on signal for the linear regulators
  Should add a dedicated translator for board power enable.
  U19 requires much more output voltage decoupling
- Rated current 300mA
  Expected current 40mA
- Coppied this from previous Mezzanine schematic - I guess it was to help isolation between digital and analog ground
- File:
- Size:
- Date:
- Letter
- Revision:
- Sheet
- of
- Cosmology
- Drawn by:
- (in symbol CAP4532) +
- (in symbol CAP TANT CASE-A) +
- (in symbol LT1716CS5) VCC; GND

### Library data of the parts
+2.5VA +2.5VD +5VA +5VD -5VA BuckSync In5V5n In5V5p Ip3V7n Ip3V7p Ip5V5n Ip5V5p TMON1 TMON2 = TestPoint: TestPoint1; Assembly Comments: none; Footprint: *; Type: Test Point; SupplierUnitCost: 0
C49 C51 = CAP 1210: as C1 on sheet ADC; Type: Capacitor; SupplierUnitCost: $1.1; Value: 33uF; Supplier 1: Digi-Key; Supplier Part Number 1: 445-8046-1-ND
C50 C52-C54 C58 C68 C82 C93-C95 C103 C109 = CAP 0603: as C8 on sheet ADC; Manufacturers Part Number: Generic; Type: Capacitor; SupplierUnitCost: 0
  C50 C54: Value: 0.33uF
  C52 C53 C93-C95: Value: 0.1uF
  C58 C68: Value: 22pF
  C82 C103 C109: Value: 10nF
C55 C56 C96-C98 C100 C101 C104 C107 C108 C111 = CAP4532: 33u, 16V, 20%, 4532C, X5R; Manufacturer: TDK Corporation; Manufacturers Part Number: C4532X5R1C336M; Type: Capacitor; Assembly Comments: none; Part Constraints: 33u, 16V, 20%, 4532C, X5R; SupplierUnitCost: $1.30; Supplier 1: Digi-Key; Supplier Part Number 1: 445-1443-1-ND; Value: 33uF
C57 C59 = CAP 0603: Capacitor, Ceramic, 0603; Part Constraints: 10% 10V X5R 0603; Manufacturer: Generic; Assembly Comments: none; Manufacturers Part Number: Generic; Type: Capacitor; SupplierUnitCost: 0; Value: 2.2uF
C99 C102 C106 C110 = CAP TANT CASE-A: TantA Cap; Manufacturer: Generic; Part Constraints: 16V TantA; Type: Capacitor; Assembly Comments: none; Manufacturers Part Number: Generic; SupplierUnitCost: 0; Value: 10uF
DP1 DP2 = LED, yellow, 0805, 2mA: LED; Part Constraints: 511-1293-1-ND; Manufacturer: Rohm Semiconductor; Manufacturers Part Number: SML-211YTT86; Assembly Comments: none; Supplier 1: Digi-Key; Supplier Part Number 1: 511-1293-1-ND; Type: LED; SupplierUnitCost: $0.64
J4 = Header 3: Header, 0.1"  3-Pin; Manufacturer: Molex; Manufacturers Part Number: 0099990987; Assembly Comments: none; Part Constraints: 0099990987; Type: Header; SupplierUnitCost: $1.00
L10-L13 = INDPM54: Inductor PM54; Manufacturer: Bourns Inc.; Manufacturers Part Number: PM54-680K; Assembly Comments: none; Footprint: PM54; Type: Inductor; SupplierUnitCost: $1.12; Supplier 1: Digi-Key; Supplier Part Number 1: M8524CT-ND; Value: 68uH
L15 L16 = IND IHLP1212: Inductor IHLP1212; Manufacturer: Vishay Dale; Manufacturers Part Number: IHLP1212BZER1R5M11; Assembly Comments: none; Footprint: IHLP1212; Type: Inductor; SupplierUnitCost: $1.30; Value: 1.5uH; Supplier 1: Digi-Key; Supplier Part Number 1: 541-1321-1-ND
L17 = IND 0805: as L14 on sheet MGMEZZ02; Type: Inductor; SupplierUnitCost: $0.33; Value: 100uH 0805
R27 R28 R33-R42 R60-R75 R85 R86 R102 R103 = RES 0603: Resistor; Manufacturer: Generic; Part Constraints: 1% 1/10W 100ppm 0603; Assembly Comments: none; Manufacturers Part Number: Generic; Type: Resistor; SupplierUnitCost: 0
  R27 R85: Value: 309k
  R28 R40 R42 R60-R63 R70 R71 R74 R75 R86: Value: 100k
  R33-R35: Value: 249
  R36 R37: Value: 4.99
  R38: Value: DNL
  R39 R64 R65 R72 R73: Value: 31.6k
  R41: Value: 105k
  R66-R69: Value: 160k
  R102: Value: 4.99k
  R103: Value: 348
R43-R46 = RES 0805: RES 0.1 OHM 1/8W 0805 SMD; Manufacturer: Panasonic Electronic Components; Part constraints: 1% 100ppm 1/8W 0805; Manufacturers Part Number: ERJ-L06KF10CV; Assembly Comments: none; Type: Resistor; SupplierUnitCost: $0.83; Value: 0.1 0805; Supplier 1: Digi-Key; Supplier Part Number 1: P100LLCT-ND
R58 R59 R78 R79 R109 = RES 0805: RES 0.0 OHM 1/8W 0805 SMD; Manufacturer: Generic; Part constraints: 1% 100ppm 1/8W 0805; Assembly Comments: none; Manufacturers Part Number: Generic; Type: Resistor; SupplierUnitCost: 0; Value: 0
R80 R81 = RES 1206: RES 0.0 OHM 1/8W 1206 SMD; Manufacturer: Generic; Part constraints: 1% 100ppm 1/8W 1206; Assembly Comments: none; Manufacturers Part Number: Generic; Type: Resistor; SupplierUnitCost: 0; Value: 0
U10 U11 = LTC3626: 20V, 2.5A Sync buck, 3Mhz; Part Constraints: LTC3626EUDC#PBF; Manufacturer: Linear Technology; Assembly Comments: none; Supplier 1: Digi-Key; Supplier Part Number 1: LTC3626EUDC#PBF-ND; Manufacturers Part Number: LTC3626EUDC#PBF; Type: IC; SupplierUnitCost: $8.10
U12 U14 U19 = LT1962EMS8: REG, micropower, low noise, low  dropout; Manufacturer: Linear Technology; Manufacturers Part Number: LT1962EMS8#PBF; Part Constraints: LT1962EMS8; Supplier 1: Digi-Key; Supplier Part Number 1: LT1962EMS8#PBF-ND
U13 = LT1175IS8: REG, negative micropower low dropout; Manufacturer: Linear Technology; Manufacturers Part Number: LT1175IS8#PBF; Part Constraints: LT1175IS8; Supplier 1: Digi-Key; Supplier Part Number 1: LT1175IS8#PBF-ND
U18 = LT1716CS5: Comparator 2.7V to 44V rail to rail; Manufacturer: Linear Technology; Part Constraints: LT1716CS5#TRMPBF; Assembly Comments: none; Manufacturers Part Number: LT1716CS5#TRMPBF; SupplierUnitCost: $2.75; Type: IC; Supplier 1: Digi-Key; Supplier Part Number 1: LT1716CS5#TRMPBFCT-ND

## Sheet FastDAC.SchDoc: Fast DAC
size Letter
Used 4 times, as channels A, B, C, D. Parts and nets are listed once, with the designators drawn on the sheet.
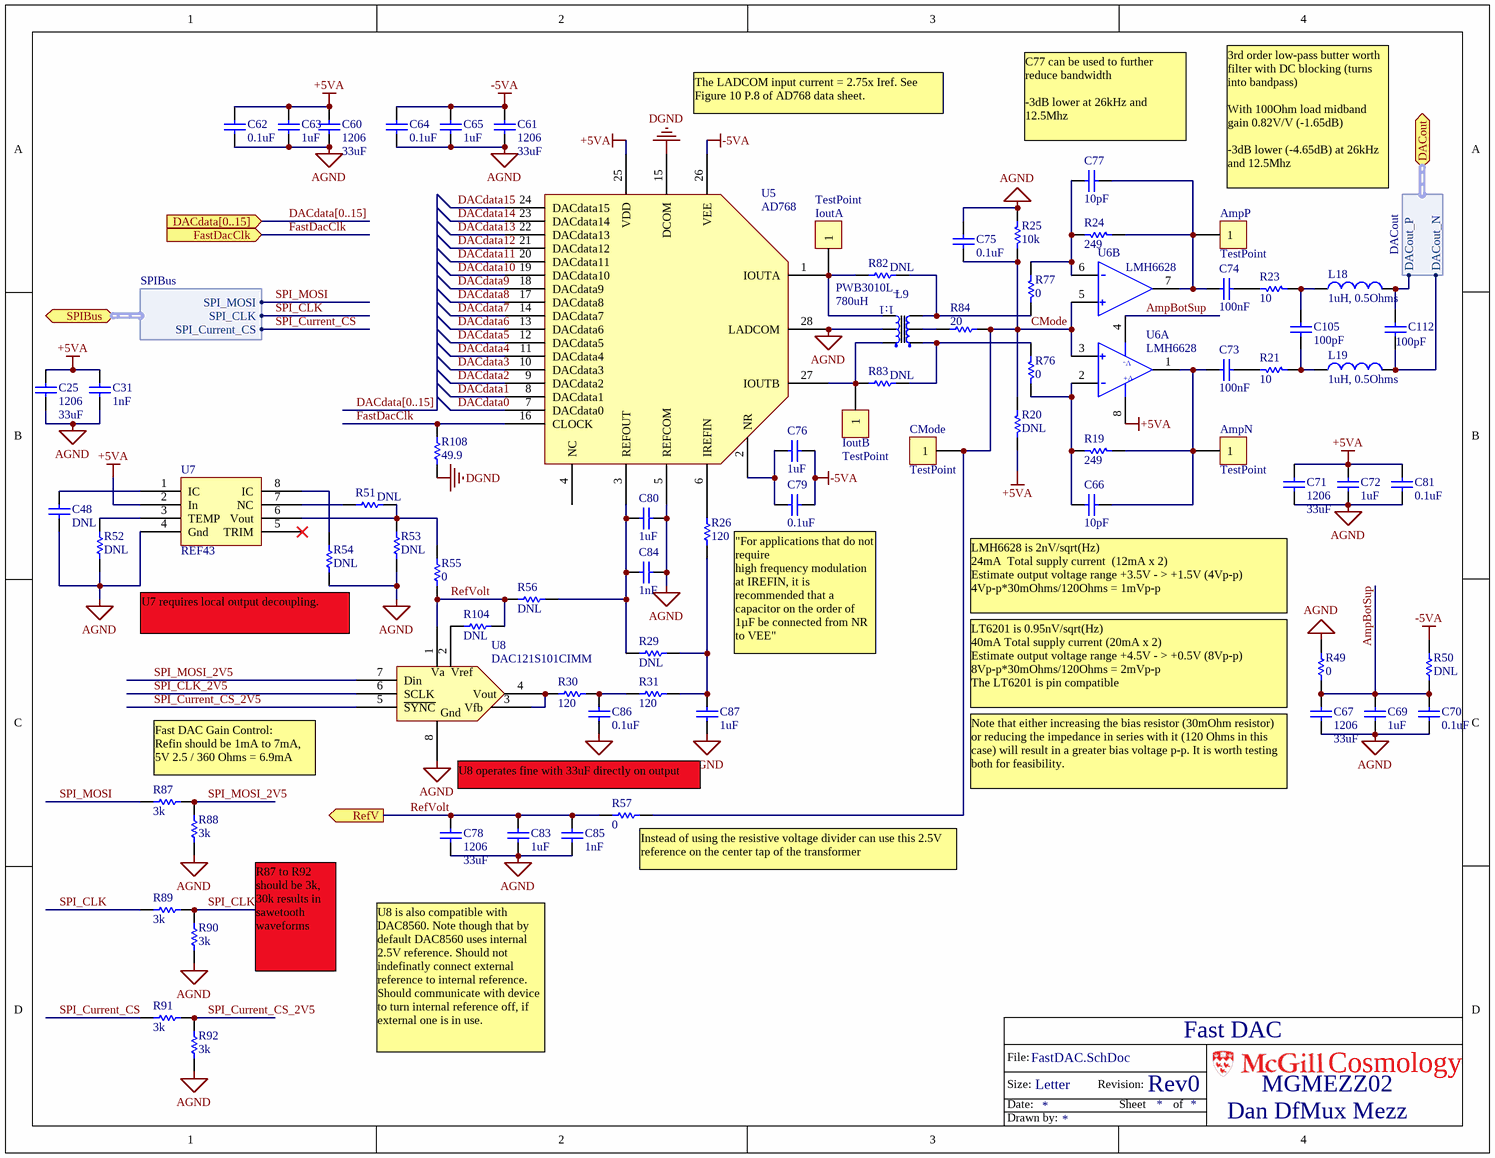
[diagram p3: FastDAC.SchDoc]

### Parts
AmpN  TestPoint  [TP-3520-SK]  (no BOM)
AmpP  TestPoint  [TP-3520-SK]  (no BOM)
C25  Footprint: 1206  [CC3225-1210]  (hidden comment: 33uF)
C31  1nF  [0603]
C48  DNL  [0603]
C60  Footprint: 1206  [CC3225-1210]  (hidden comment: 33uF)
C61  Footprint: 1206  [CC3225-1210]  (hidden comment: 33uF)
C62  0.1uF  [0603]
C63  1uF  [0603]
C64  0.1uF  [0603]
C65  1uF  [0603]
C66  10pF  [0603]
C67  Footprint: 1206  [CC3225-1210]  (hidden comment: 33uF)
C69  1uF  [0603]
C70  0.1uF  [0603]
C71  Footprint: 1206  [CC3225-1210]  (hidden comment: 33uF)
C72  1uF  [0603]
C73  100nF  [0603]
C74  100nF  [0603]
C75  0.1uF  [0603]
C76  1uF  [0603]
C77  10pF  [0603]
C78  Footprint: 1206  [CC3225-1210]  (hidden comment: 33uF)
C79  0.1uF  [0603]
C80  1uF  [0603]
C81  0.1uF  [0603]
C83  1uF  [0603]
C84  1nF  [0603]
C85  1nF  [0603]
C86  0.1uF  [0603]
C87  1uF  [0603]
C105  100pF  [0603]
C112  100pF  [0603]
CMode  TestPoint  [TP-3520-SK]  (no BOM)
IoutA  TestPoint  [TP-3520-SK]  (no BOM)
IoutB  TestPoint  [TP-3520-SK]  (no BOM)
L9  PWB3010L_  value 780uH  [PWB]
L18  1uH, 0.5Ohms  [0805]
L19  1uH, 0.5Ohms  [0805]
R19  249  [0603]
R20  DNL  [0603]
R21  10  [0603]
R23  10  [0603]
R24  249  [0603]
R25  10k  [0603]
R26  120  [0603]
R29  DNL  [0603]
R30  120  [0603]
R31  120  [0603]
R49  0  [0603]
R50  DNL  [0603]
R51  DNL  [0603]
R52  DNL  [0603]
R53  DNL  [0603]
R54  DNL  [0603]
R55  0  [0603]
R56  DNL  [0603]
R57  0  [0603]
R76  0  [0603]
R77  0  [0603]
R82  DNL  [0603]
R83  DNL  [0603]
R84  20  [0603]
R87  3k  [0603]
R88  3k  [0603]
R89  3k  [0603]
R90  3k  [0603]
R91  3k  [0603]
R92  3k  [0603]
R104  DNL  [0603]
R108  49.9  [0603]
U5  AD768  [SOIC 28 300mils]
U6  LMH6628  [SO8]  (parts A,B of 2)
U7  REF43  [SO8]
U8  DAC121S101CIMM  [MSOP-8]

### Ports
DACdata[0..15] (in), DACout (harness DACout), FastDacClk (in), RefV (out), SPIBus (harness SPIBus)

### Harnesses
DACout: DACout_N, DACout_P
SPIBus: SPI_MOSI, SPI_CLK, SPI_Current_CS

### Nets
+5VA: C25.1 C31.1 C60.2 C62.2 C63.2 C71.2 C72.1 C81.1 R20.2 U5.25(VDD) U6.8(V+) U7.2(In)
-5VA: C61.2 C64.2 C65.2 C76.1 C79.1 R50.2 U5.26(VEE)
AGND: C25.2 C31.2 C48.2 C60.1 C61.1 C62.1 C63.1 C64.1 C65.1 C67.1 C69.2 C70.2 C71.1 C72.2 C75.1 C78.2 C80.2 C81.2 C83.2 C84.2 C85.2 C86.2 C87.2 L9.2(PrimCent) R25.1 R49.2 R52.2 R53.1 R54.2 R88.2 R90.2 R92.2 U5.5(REFCOM) U5.28(LADCOM) U7.4(Gnd) U8.8(Gnd)
DGND: R108.1 U5.15(DCOM)
AmpBotSup: C67.2 C69.1 C70.1 R49.1 R50.1 U6.4(V-)
CMode: C75.2 CMode.1 R20.1 R25.2 R57.2 R84.2 U6.3(IN+) U6.5(IN+)
DACdata0: U5.7(DACdata0)
DACdata1: U5.8(DACdata1)
DACdata2: U5.9(DACdata2)
DACdata3: U5.10(DACdata3)
DACdata4: U5.11(DACdata4)
DACdata5: U5.12(DACdata5)
DACdata6: U5.13(DACdata6)
DACdata7: U5.14(DACdata7)
DACdata8: U5.17(DACdata8)
DACdata9: U5.18(DACdata9)
DACdata10: U5.19(DACdata10)
DACdata11: U5.20(DACdata11)
DACdata12: U5.21(DACdata12)
DACdata13: U5.22(DACdata13)
DACdata14: U5.23(DACdata14)
DACdata15: U5.24(DACdata15)
FastDacClk: R108.2 U5.16(CLOCK) ; port FastDacClk
RefVolt: C78.1 C83.1 C85.1 R55.2 R56.1 R57.1 R104.2 U8.1(Va) ; port RefV
SPI_CLK: R89.1 ; port SPIBus.SPI_CLK
SPI_CLK_2V5: R89.2 R90.1 U8.6(SCLK)
SPI_Current_CS: R91.1 ; port SPIBus.SPI_Current_CS
SPI_Current_CS_2V5: R91.2 R92.1 U8.5(~{SYNC})
SPI_MOSI: R87.1 ; port SPIBus.SPI_MOSI
SPI_MOSI_2V5: R87.2 R88.1 U8.7(Din)
NetAmpN_1: AmpN.1 C66.2 C73.2 R19.2 U6.1(Out)
NetAmpP_1: AmpP.1 C74.2 C77.2 R24.2 U6.7(Out)
NetC48_1: C48.1 U7.1(IC)
NetC66_1: C66.1 R19.1 R76.1 U6.2(IN-)
NetC73_1: C73.1 R21.1
NetC74_1: C74.1 R23.1
NetC76_2: C76.2 C79.2 U5.2(NR)
NetC77_1: C77.1 R24.1 R77.2 U6.6(IN-)
NetC80_1: C80.1 C84.1 R29.1 R56.2 U5.3(REFOUT)
NetC86_1: C86.1 R30.1 R31.2
NetC87_1: C87.1 R26.2 R29.2 R31.1
NetC105_1: C105.1 L18.1 R23.2
NetC105_2: C105.2 L19.1 R21.2
NetC112_1: C112.1 L18.2 ; port DACout.DACout_P
NetC112_2: C112.2 L19.2 ; port DACout.DACout_N
NetIoutA_1: IoutA.1 L9.3(Prim) R82.2 U5.1(IOUTA)
NetIoutB_1: IoutB.1 L9.1(PrimDot) R83.2 U5.27(IOUTB)
NetL9_4: L9.4(Sec) R77.1 R82.1
NetL9_5: L9.5(SecCent) R84.1
NetL9_6: L9.6(SecDot) R76.2 R83.1
NetR26_1: R26.1 U5.6(IREFIN)
NetR30_2: R30.2 U8.3(NC) U8.4(Vout)
NetR51_1: R51.1 R53.2 R55.1 U7.6(Vout)
NetR51_2: R51.2 U7.7(NC)
NetR52_1: R52.1 U7.3(TEMP)
NetR54_1: R54.1 U7.8(IC)
NetR104_1: R104.1 U8.2(NC)

Not connected (* = marked no-connect by the designer): U5 4(NC); U7 5(TRIM)*

### Channels
A: designators end in A; ports FastDacClk=FastDacClk RefV=RefVolt_A
B: designators end in B; ports FastDacClk=FastDacClk RefV=RefVolt
C: designators end in C; ports FastDacClk=FastDacClk RefV=RefVolt
D: designators end in D; ports FastDacClk=FastDacClk RefV=RefVolt_D

### Buses and harness runs
bus DACdata[0..15]
bus DACdata[0..15] = port DACdata[0..15]

### Notes on the sheet
- The LADCOM input current = 2.75x Iref. See Figure 10 P.8 of AD768 data sheet.
- (near C77) C77 can be used to further reduce bandwidth
  -3dB lower at 26kHz and 12.5Mhz
- (near AmpP) 3rd order low-pass butter worth filter with DC blocking (turns into bandpass)
  With 100Ohm load midband gain 0.82V/V (-1.65dB)
  -3dB lower (-4.65dB) at 26kHz and 12.5Mhz
- (near R54) U7 requires local output decoupling.
- LMH6628 is 2nV/sqrt(Hz)
  24mA  Total supply current  (12mA x 2)
  Estimate output voltage range +3.5V - > +1.5V (4Vp-p)
  4Vp-p*30mOhms/120Ohms = 1mVp-p
- "For applications that do not require
  high frequency modulation at IREFIN, it is recommended that a capacitor on the order of 1µF be connected from NR to VEE"
- LT6201 is 0.95nV/sqrt(Hz)
  40mA Total supply current (20mA x 2)
  Estimate output voltage range +4.5V - > +0.5V (8Vp-p)
  8Vp-p*30mOhms/120Ohms = 2mVp-p
  The LT6201 is pin compatible
- Fast DAC Gain Control:
  Refin should be 1mA to 7mA, 5V 2.5 / 360 Ohms = 6.9mA
- U8 operates fine with 33uF directly on output
- Note that either increasing the bias resistor (30mOhm resistor) or reducing the impedance in series with it (120 Ohms in this case) will result in a greater bias voltage p-p. It is worth testing both for feasibility.
- (near R57) Instead of using the resistive voltage divider can use this 2.5V reference on the center tap of the transformer
- R87 to R92 should be 3k, 30k results in sawetooth waveforms
- U8 is also compatible with DAC8560. Note though that by default DAC8560 uses internal 2.5V reference. Should not indefinatly connect external reference to internal reference. Should communicate with device to turn internal reference off, if external one is in use.
- File:
- Size:
- Date:
- Letter
- Revision:
- Sheet
- of
- Cosmology
- Drawn by:
- (in symbol PWB-1-CLB) 1:1

### Library data of the parts
AmpN AmpP CMode IoutA IoutB = TestPoint: TestPoint1; Assembly Comments: none; Footprint: *; Type: Test Point; SupplierUnitCost: 0
C25 C60 C61 C67 C71 C78 = CAP 1210: as C1 on sheet ADC; Type: Capacitor; SupplierUnitCost: $1.1; Value: 33uF; Supplier 1: Digi-Key; Supplier Part Number 1: 445-8046-1-ND
C31 C48 C62 C64 C66 C70 C73-C75 C77 C79 C81 C84-C86 C105 C112 = CAP 0603: as C5 on sheet ADC; Manufacturers Part Number: Generic; Type: Capacitor; SupplierUnitCost: 0
  C31 C84 C85: Value: 1nF
  C48: Value: DNL
  C62 C64 C70 C75 C79 C81 C86: Value: 0.1uF
  C66 C77: Value: 10pF
  C73 C74: Value: 100nF
  C105 C112: Value: 100pF
C63 C65 C69 C72 C76 C80 C83 C87 = CAP 0603: as C10 on sheet ADC; Value: 1uF; Type: Capacitor; SupplierUnitCost: $0.12
L9 = PWB-1-CLB: Transformer; Manufacturer: Coil Craft; Assembly Comments: none; Manufacturers Part Number: PWB3010L_; Part Constraints: PWB3010L_; Supplier 1: Coil Craft; Supplier Part Number 1: PWB3010L_; SupplierUnitCost: $3.25
L18 L19 = IND 0805: Inductor 0805; Manufacturer: EPCOS Inc; Manufacturers Part Number: B82498F1102J; Part Constraints: 1uH, 0.5Ohms DRC, 440Mhz SRF, Irms 0.24A, 5%; Assembly Comments: none; Type: Inductor; SupplierUnitCost: $1.06; Value: 1uH, 0.5Ohms; Supplier 1: Digi-Key; Supplier Part Number 1: 495-1844-1-ND
R19-R21 R23-R26 R29-R31 R49-R57 R76 R77 R82-R84 R104 R108 = RES 0603: as R1 on sheet ADC; Manufacturers Part Number: Generic; Type: Resistor; SupplierUnitCost: 0
  R19 R24: Value: 249
  R20 R29 R50-R54 R56 R82 R83 R104: Value: DNL
  R21 R23: Value: 10
  R25: Value: 10k
  R26 R30 R31: Value: 120
  R49 R55 R57 R76 R77: Value: 0
  R84: Value: 20
  R108: Value: 49.9
R87-R92 = RES 0603: as R27 on sheet Power; Manufacturers Part Number: Generic; Type: Resistor; SupplierUnitCost: 0; Value: 3k
U5 = AD768: DAC 16bit 30MSPS; Manufacturers Part Number: AD768ARZ; Manufacturer: Analog Devices; Assembly Comments: none; Part Constraints: AD768ARZ; Supplier 1: Digi-Key; Supplier Part Number 1: AD768ARZ-ND; Type: IC; SupplierUnitCost: $46.27
U6 = LMH6628: Dual Opamp 200Mhz GBP Soic 8; Part Constraints: LMH6628MA/NOPB; Manufacturer: National Semiconductor; Assembly Comments: none; Manufacturers Part Number: LMH6628MA/NOPB; Type: IC; SupplierUnitCost: $4.44; Supplier 1: Digi-Key; Supplier Part Number 1: LMH6628MA-ND
U7 = REF43: Voltage Referance; Part Constraints: REF43GSZ; Manufacturer: Analog Devices; Assembly Comments: none; Manufacturers Part Number: REF43GSZ; SupplierUnitCost: $9.87; Supplier 1: Digi-Key; Supplier Part Number 1: REF43GSZ-ND
U8 = DAC121S101CIMM/NOPB: CONV D/A 12BIT MICROPWR 8MSOP; Manufacturer: National Semiconductor; Settling Time: 12µs; Number of Bits: 12; Data Interface: DSP, MICROWIRE™, QSPI™, Serial, SPI™; Number of Converters: 1; Voltage Supply Source: Single Supply; Power Dissipation (Max): 1.72mW; Number of Outputs and Type: 1 Voltage, Unipolar; 1 Voltage, Bipolar; Assembly Comments: none; RoHS: RoHS Compliant; Category: Integrated Circuits (ICs); Stock 1: 3011; Pricing 1: 1=3.5, 25=2.8616, 100=2.5698, 250=2.33624, 500=2.0442 (CAD); Operating Temperature: -40°C ~ 105°C; Mounting Type: Surface Mount; Package / Case: 8-TSSOP, 8-MSOP (0.118", 3.00mm Width); Supplier Device Package: 8-MSOP; Packaging: Cut Tape (CT); Sampling Rate (Per Second): *; ComponentLink1URL: http://www.ti.com/lit/ds/symlink/dac121s101.pdf; ComponentLink1Description: http://www.ti.com/lit/ds/symlink/dac121s101.pdf; Supplier 1: Digi-Key; Supplier Part Number 1: DAC121S101CIMMCT-ND; Part Constraints: DAC121S101CIMM/NOPB; Manufacturers Part Number: DAC121S101CIMM/NOPB; Type: IC; SupplierUnitCost: $3.70

## Sheet Connector.SchDoc: DfMUX Mezzanine Connector
size Letter; ProjectTitle: Dan DfMux Mezz; ModelNumber: MGMEZZ04
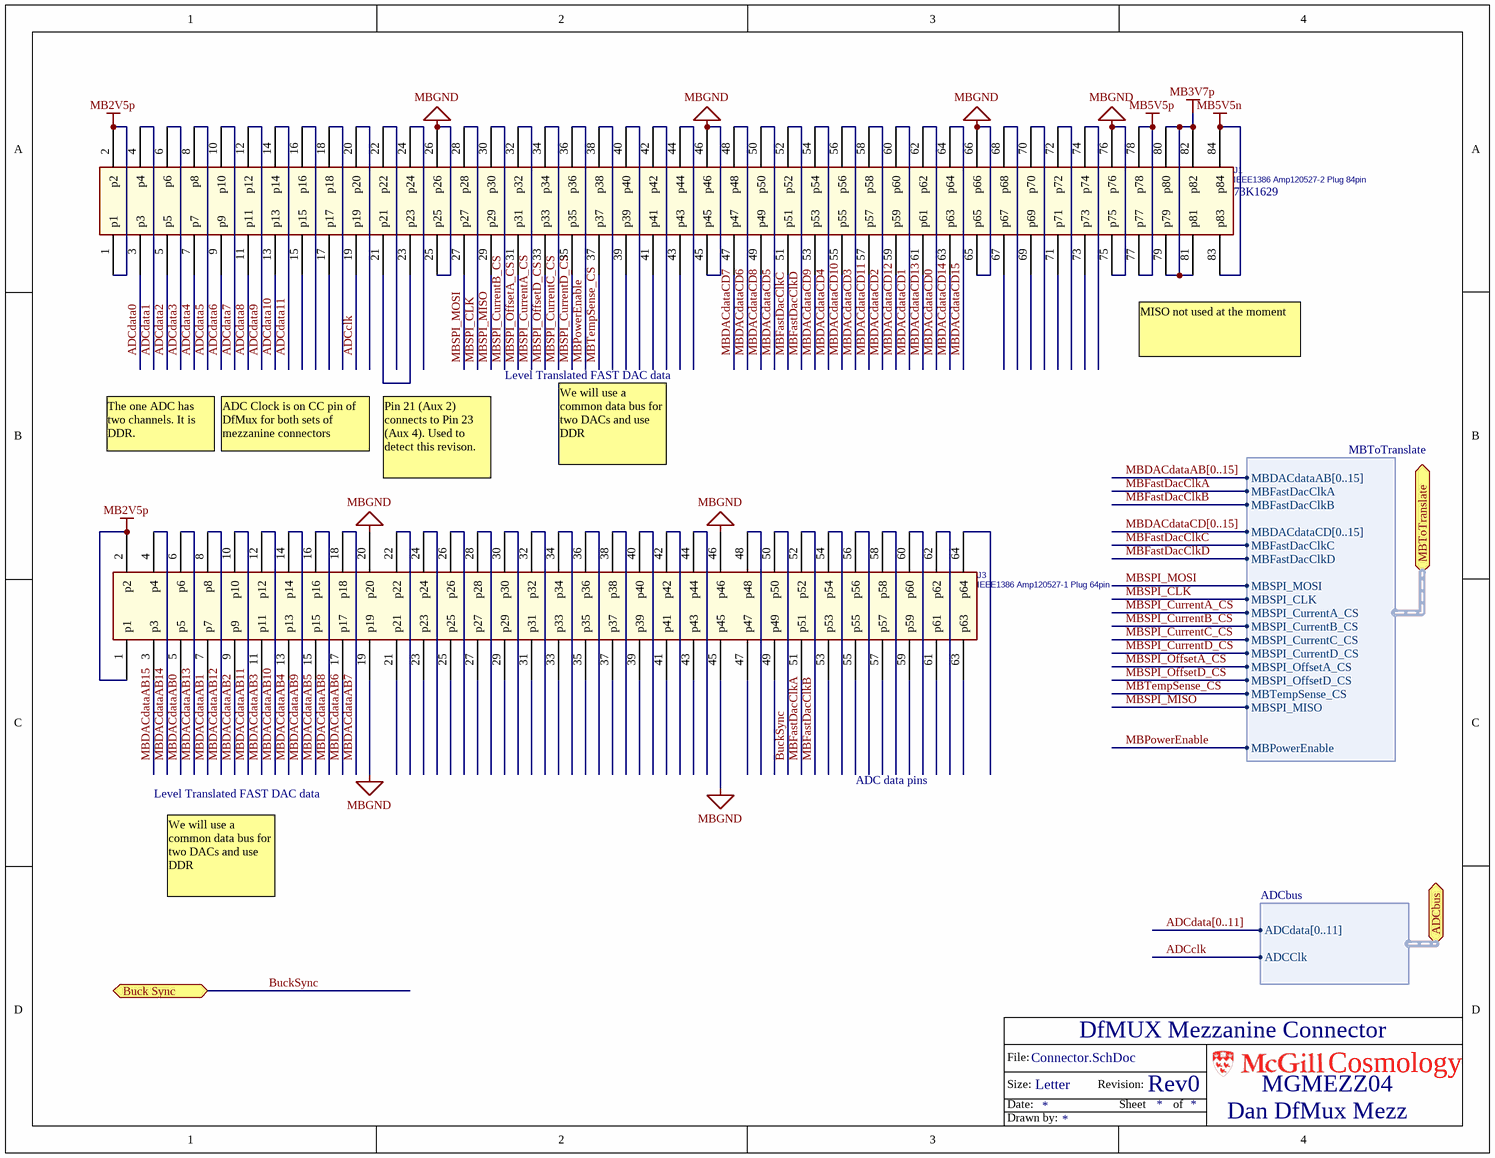
[diagram p4: Connector.SchDoc]

### Parts
J1  IEEE1386 Amp120527-2 Plug 84pin  Supplier Part Number 1: 73K1629  [CON_AMP_1MM_84PINS]
J3  IEEE1386 Amp120527-1 Plug 64pin  [CON_AMP_1MM_64PINS]

### Ports
ADCbus (harness ADCbus), Buck Sync, MBToTranslate (harness MBToTranslate)

### Harnesses
ADCbus: ADCdata[0..11], ADCClk
MBToTranslate: MBDACdataAB[0..15], MBFastDacClkA, MBSPI_MOSI, MBSPI_CLK, MBFastDacClkB, MBFastDacClkC, MBFastDacClkD, MBDACdataCD[0..15], MBPowerEnable, MBSPI_CurrentA_CS, MBSPI_CurrentB_CS, MBSPI_CurrentC_CS, MBSPI_CurrentD_CS, MBSPI_OffsetA_CS, MBSPI_OffsetD_CS, MBTempSense_CS, MBSPI_MISO

### Nets
MB2V5p: J1.1(p1) J1.2(p2) J3.1(p1) J3.2(p2)
MB3V7p: J1.79(p79) J1.80(p80) J1.81(p81) J1.82(p82)
MB5V5n: J1.83(p83) J1.84(p84)
MB5V5p: J1.77(p77) J1.78(p78)
MBGND: J1.25(p25) J1.26(p26) J1.45(p45) J1.46(p46) J1.65(p65) J1.66(p66) J1.75(p75) J1.76(p76) J3.19(p19) J3.20(p20) J3.45(p45) J3.46(p46)
ADCclk: J1.19(p19) ; port ADCbus.ADCClk
ADCdata0: J1.3(p3)
ADCdata1: J1.4(p4)
ADCdata2: J1.5(p5)
ADCdata3: J1.6(p6)
ADCdata4: J1.7(p7)
ADCdata5: J1.8(p8)
ADCdata6: J1.9(p9)
ADCdata7: J1.10(p10)
ADCdata8: J1.11(p11)
ADCdata9: J1.12(p12)
ADCdata10: J1.13(p13)
ADCdata11: J1.14(p14)
BuckSync: J3.50(p50) ; port Buck Sync
MBDACdataAB0: J3.5(p5)
MBDACdataAB1: J3.7(p7)
MBDACdataAB2: J3.9(p9)
MBDACdataAB3: J3.11(p11)
MBDACdataAB4: J3.13(p13)
MBDACdataAB5: J3.15(p15)
MBDACdataAB6: J3.17(p17)
MBDACdataAB7: J3.18(p18)
MBDACdataAB8: J3.16(p16)
MBDACdataAB9: J3.14(p14)
MBDACdataAB10: J3.12(p12)
MBDACdataAB11: J3.10(p10)
MBDACdataAB12: J3.8(p8)
MBDACdataAB13: J3.6(p6)
MBDACdataAB14: J3.4(p4)
MBDACdataAB15: J3.3(p3)
MBDACdataCD0: J1.62(p62)
MBDACdataCD1: J1.60(p60)
MBDACdataCD2: J1.58(p58)
MBDACdataCD3: J1.56(p56)
MBDACdataCD4: J1.54(p54)
MBDACdataCD5: J1.50(p50)
MBDACdataCD6: J1.48(p48)
MBDACdataCD7: J1.47(p47)
MBDACdataCD8: J1.49(p49)
MBDACdataCD9: J1.53(p53)
MBDACdataCD10: J1.55(p55)
MBDACdataCD11: J1.57(p57)
MBDACdataCD12: J1.59(p59)
MBDACdataCD13: J1.61(p61)
MBDACdataCD14: J1.63(p63)
MBDACdataCD15: J1.64(p64)
MBFastDacClkA: J3.51(p51) ; port MBToTranslate.MBFastDacClkA
MBFastDacClkB: J3.52(p52) ; port MBToTranslate.MBFastDacClkB
MBFastDacClkC: J1.51(p51) ; port MBToTranslate.MBFastDacClkC
MBFastDacClkD: J1.52(p52) ; port MBToTranslate.MBFastDacClkD
MBPowerEnable: J1.36(p36) ; port MBToTranslate.MBPowerEnable
MBSPI_CLK: J1.28(p28) ; port MBToTranslate.MBSPI_CLK
MBSPI_CurrentA_CS: J1.32(p32) ; port MBToTranslate.MBSPI_CurrentA_CS
MBSPI_CurrentB_CS: J1.30(p30) ; port MBToTranslate.MBSPI_CurrentB_CS
MBSPI_CurrentC_CS: J1.34(p34) ; port MBToTranslate.MBSPI_CurrentC_CS
MBSPI_CurrentD_CS: J1.35(p35) ; port MBToTranslate.MBSPI_CurrentD_CS
MBSPI_MISO: J1.29(p29) ; port MBToTranslate.MBSPI_MISO
MBSPI_MOSI: J1.27(p27) ; port MBToTranslate.MBSPI_MOSI
MBSPI_OffsetA_CS: J1.31(p31) ; port MBToTranslate.MBSPI_OffsetA_CS
MBSPI_OffsetD_CS: J1.33(p33) ; port MBToTranslate.MBSPI_OffsetD_CS
MBTempSense_CS: J1.37(p37) ; port MBToTranslate.MBTempSense_CS
NetJ1_21: J1.21(p21) J1.23(p23)

Not connected (* = marked no-connect by the designer): J1 15(p15) 16(p16) 17(p17) 18(p18) 20(p20) 22(p22) 24(p24) 38(p38) 39(p39) 40(p40) 41(p41) 42(p42) 43(p43) 44(p44) 67(p67) 68(p68) 69(p69) 70(p70) 71(p71) 72(p72) 73(p73) 74(p74); J3 21(p21) 22(p22) 23(p23) 24(p24) 25(p25) 26(p26) 27(p27) 28(p28) 29(p29) 30(p30) 31(p31) 32(p32) 33(p33) 34(p34) 35(p35) 36(p36) 37(p37) 38(p38) 39(p39) 40(p40) 41(p41) 42(p42) 43(p43) 44(p44) 47(p47) 48(p48) 49(p49) 53(p53) 54(p54) 55(p55) 56(p56) 57(p57) 58(p58) 59(p59) 60(p60) 61(p61) 62(p62) 63(p63) 64(p64)

### Buses and harness runs
bus ADCdata[0..11]
bus MBDACdataAB[0..15]
bus MBDACdataCD[0..15]

### Notes on the sheet
- MISO not used at the moment
- Level Translated FAST DAC data
- The one ADC has two channels. It is DDR.
- ADC Clock is on CC pin of DfMux for both sets of mezzanine connectors
- Pin 21 (Aux 2) connects to Pin 23 (Aux 4). Used to detect this revison.
- We will use a common data bus for two DACs and use DDR
- ADC data pins
- File:
- Size:
- Date:
- Letter
- Revision:
- Sheet
- of
- Cosmology
- Drawn by:

### Library data of the parts
J1 = IEEE1386 Amp120527-2 Plug84pin: Part Constraints: 5120527-2; Manufacturer: TE CONNECTIVITY / AMP; Assembly Comments: none; Type: Connector; Supplier 1: Newark; Manufacturers Part Number: 5120527-2
J3 = IEEE1386 Amp120527-1 Plug 64pin: Manufacturer: TE Connectivity; Assembly Comments: none; Supplier 1: Digi-Key; Supplier Part Number 1: 120527-1-ND; Part Constraints: 120527-1; Manufacturers Part Number: 120527-1; Type: Connector